# EAGLE design TaaraESP-SHT21 (EAGLE 7.2.0)
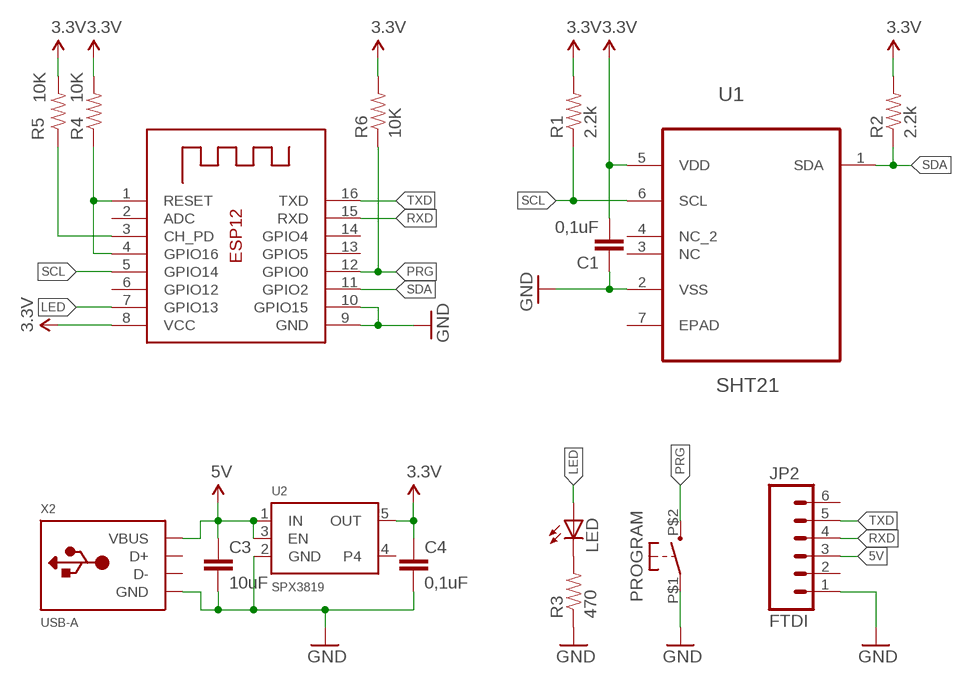
[diagram p0: schematic, sheet 1]

## Parts
C1  0,1uF  CAP0603-CAP  [0603-CAP]
C3  10uF  CAP0603-CAP  [0603-CAP]
C4  0,1uF  CAP0603-CAP  [0603-CAP]
JP2  FTDI  M06SIP_LOCK  [1X06-SIP_LOCK]
LED  LEDCHIPLED_0603  [CHIPLED_0603]
PROGRAM  OMRON_B3U-1000_TACT_SW  [BC3-1000]
R1  2.2k  RESISTOR0603-RES  [0603-RES]
R2  2.2k  RESISTOR0603-RES  [0603-RES]
R3  470  RESISTOR0603-RES  [0603-RES]
R4  10K  RESISTOR0603-RES  [0603-RES]
R5  10K  RESISTOR0603-RES  [0603-RES]
R6  10K  RESISTOR0603-RES  [0603-RES]
U1  SHT21  [DFN300X300X110-7N]
U2  SPX3819  VREG_SOT23-5  [SOT23-5]
X1  ESP-12  [ESP-12]
X2  USB-A  [MOLEX_480371000]

## Nets
3.3V: C1.2 C4.1 R1.2 R2.2 R4.2 R5.2 R6.2 U1.5(VDD) U2.5(OUT) X1.8(VCC)
5V: C3.1 JP2.3 U2.1(IN) U2.3(EN) X2.1(VBUS)
GND: C1.1 C3.2 C4.2 JP2.1 PROGRAM.P$1 R3.1 U1.2(VSS) U2.2(GND) X1.9(GND) X1.10(GPIO15) X2.4(GND)
LED: LED.A X1.7(GPIO13)
N$1: LED.C R3.2
N$2: R4.1 X1.1(RESET) X1.4(GPIO16)
N$3: R5.1 X1.3(CH_PD)
PRG: PROGRAM.P$2 R6.1 X1.12(GPIO0)
RXD: JP2.4 X1.15(RXD)
SCL: R1.1 U1.6(SCL) X1.5(GPIO14)
SDA: R2.1 U1.1(SDA) X1.11(GPIO2)
TXD: JP2.5 X1.16(TXD)
Unconnected: JP2.2 JP2.6 U1.3(NC) U1.4(NC_2) U1.7(EPAD) U2.4 X1.2(ADC) X1.6(GPIO12) X1.13(GPIO5) X1.14(GPIO4) X2.2(D-) X2.3(D+)

## Library data of the parts
C1 C3 C4 = SparkFun:CAP: Capacitor Standard 0603 ceramic capacitor, and 0.1" leaded capacitor.
JP2 = SparkFun:M06: Header 6 Standard 6-pin 0.1" header. Use with straight break away headers (SKU : PRT-00116), right angle break away headers (PRT-00553), swiss pins (PRT-00743), machine pins (PRT-00117), and female headers (PRT-00115). Molex polarized connector foot print use with SKU : PRT-08094 with associated crimp pins and housings. NOTES ON THE VARIANTS LOCK and LOCK_LONGPADS... This footprint was designed to help hold the alignment of a through-hole component (i.e. 6-pin header) while soldering it into place. You may notice that each hole has been shifted either up or down by 0.005 of an inch from it's more standard position (which is a perfectly straight line). This slight alteration caused the pins (the squares in the middle) to touch the edges of the holes. Because they are alternating, it causes a "brace" to hold the component in place. 0.005 has proven to be the perfect amount of "off-center" position when using our standard breakaway headers. Although looks a little odd when you look at the bare footprint, once you have a header in there, the alteration is very hard to notice. Also, if you push a header all the way into place, it is covered up entirely on the bottom side. This idea of altering the position of holes to aid alignment will be further integrated into the Sparkfun Library for other footprints. It can help hold any component with 3 or more connection pins.
LED = adafruit:LED: LED OSRAM: - CHIPLED LG R971, LG N971, LY N971, LG Q971, LY Q971, LO R971, LY R971 LH N974, LH R974 LS Q976, LO Q976, LY Q976 LO Q996 - Hyper CHIPLED LW Q18S LB Q993, LB Q99A, LB R99A - SideLED LS A670, LO A670, LY A670, LG A670, LP A670 LB A673, LV A673, LT A673, LW A673 LH A674 LY A675 LS A676, LA A676, LO A676, LY A676, LW A676 LS A679, LY A679, LG A679 - Hyper Micro SIDELED® LS Y876, LA Y876, LO Y876, LY Y876 LT Y87S - SmartLED LW L88C, LW L88S LB L89C, LB L89S, LG L890 LS L89K, LO L89K, LY L89K LS L896, LA L896, LO L896, LY L896 - TOPLED LS T670, LO T670, LY T670, LG T670, LP T670 LSG T670, LSP T670, LSY T670, LOP T670, LYG T670 LG T671, LOG T671, LSG T671 LB T673, LV T673, LT T673, LW T673 LH T674 LS T676, LA T676, LO T676, LY T676, LB T676, LH T676, LSB T676, LW T676 LB T67C, LV T67C, LT T67C, LS T67K, LO T67K, LY T67K, LW E67C LS E67B, LA E67B, LO E67B, LY E67B, LB E67C, LV E67C, LT E67C LW T67C LS T679, LY T679, LG T679 LS T770, LO T770, LY T770, LG T770, LP T770 LB T773, LV T773, LT T773, LW T773 LH T774 LS E675, LA E675, LY E675, LS T675 LS T776, LA T776, LO T776, LY T776, LB T776 LHGB T686 LT T68C, LB T68C - Hyper Mini TOPLED® LB M676 - Mini TOPLED Santana® LG M470 LS M47K, LO M47K, LY M47K Source: http://www.osram.convergy.de/
PROGRAM = ModernDevice:OMRON_B3U-1000_TACT_SW
R1-R6 = SparkFun:RESISTOR: Resistor Basic schematic elements and footprints for 0603, 1206, and PTH resistors.
U1 = Sensirion-SHT21:SHT21: SENSOR, HUMIDITY & TEMP; MPN: SHT21; OC_FARNELL: 1855468; OC_NEWARK: 20T1172; PACKAGE: DFN-6; SUPPLIER: SENSIRION
U2 = microbuilder:VREG_SOT23-5: SOT23-5 Fixed Voltage Regulators Part Current Out V Out V In V Dropout θJA (°C/W) TJ (°C) Digikey Part No. ADP121 150mA 3.3V 3.4-5.5V 0.09V @ 150mA -- -- ADP121-AUJZ33R7CT-ND ADP121 150mA 3.0V 3.1-5.5V 0.09V @ 150mA -- -- ADP121-AUJZ30R7CT-ND ADP122 300mA 3.3V 3.4-5.5V 0.085V @ 300mA -- -- ADP122AUJZ-3.3-R7CT-ND ADP1712 300mA 3.3V 3.5-5.5V 0.17V @ 300mA -- -- ADP1712AUJZ-3.3-R7TR-ND AP7311 (Low Cost) 150mA 3.3V 3.5-6V 0.15V @ 150mA -- -- AP7311-33WG-7DICT-ND LD39015M18R 150mA 1.8V 1.9V-5.5V 0.08V @ 100mA -- -- 497-6977-1-ND LP2985A-33DBVR 150mA 3.3V 3.3-16V 0.28V @ 150mA 206 150 296-18479-1-ND MCP1824T-3302E/OT 300mA 3.3V 3.5V-6V 0.2V @ 300mA -- -- MCP1824T-3302E/OTCT-ND MIC5205-2.5YM5 TR 150mA 2.5V 2.7-16V 0.165V @ 150mA -- -- 576-1257-2-ND MIC5205-3.0YM5 TR 150mA 3.0V 3.2V-16V 0.165V @ 150mA -- -- 576-1258-2-ND MIC5205-3.3YM5 TR 150mA 3.3V 3.5V-16V 0.165V @ 150mA -- -- 576-1259-2-ND TPS780330220 150mA 3.3V+2.2V 3.6-5.5V 250mV Max -- -- 296-23332-1-ND TDA3663/N1,135 100mA 3.3V 3.5-45V 0.18V @ 50mA -- -- 568-5343-1-ND Max operating temp can be calculated using θJA, TJ (max junction temperature), and power in watts. Set the "Maximum Ambient Temperature" until it reaches TJ ("Max Junction Temperature"), which is the absolute limit for safe use of the regulator: Heat Sink Temperature Calculator <http://www.daycounter.com/Calculators/Heat-Sink-Temperature-Calculator.phtml> For example, With 12V source into a 3.3V LP2985 and a 30mA load, we are dissipating (12V-3.3V) * 0.03A = 0.261W. With a θJA of 206 °C/W, a TJ of 150°C, and 261mW we can safely use the chip without a heat sink up to 75°C (=147.1°C Junction Temperature).
X1 = microbuilder:ESP-12
X2 = adafruit:USB-A: USB type A 'plug' Used for things that can directly connect to a USB port, say USB key

## Net classes
0 default: width 0.2 mm
1 power: width 0.2 mm

## Board
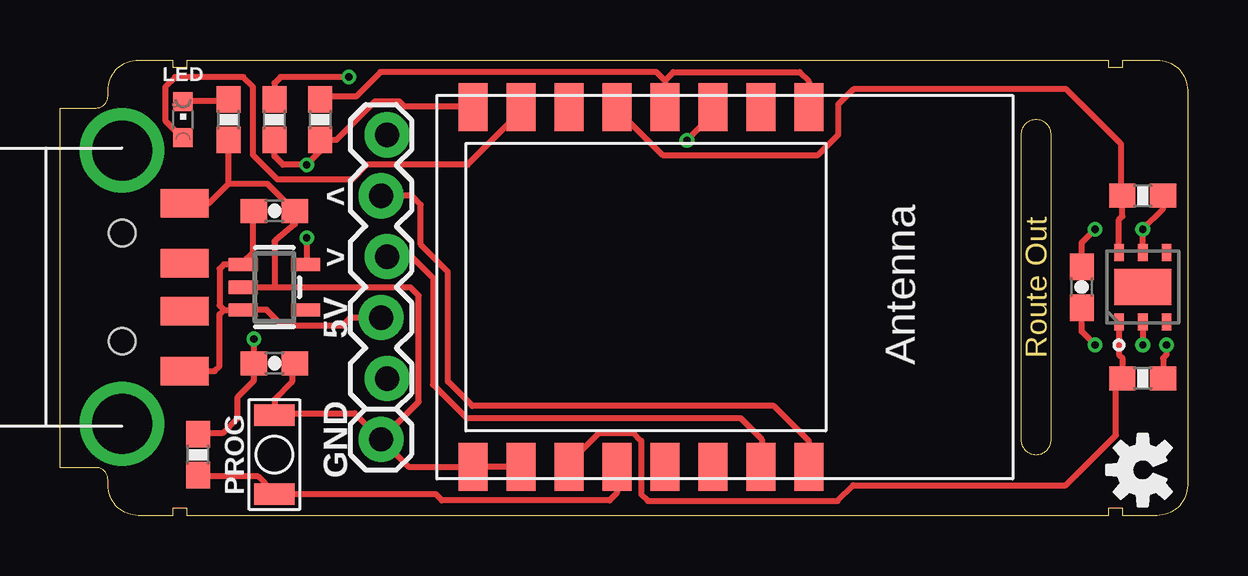
[diagram p1: board, top side]
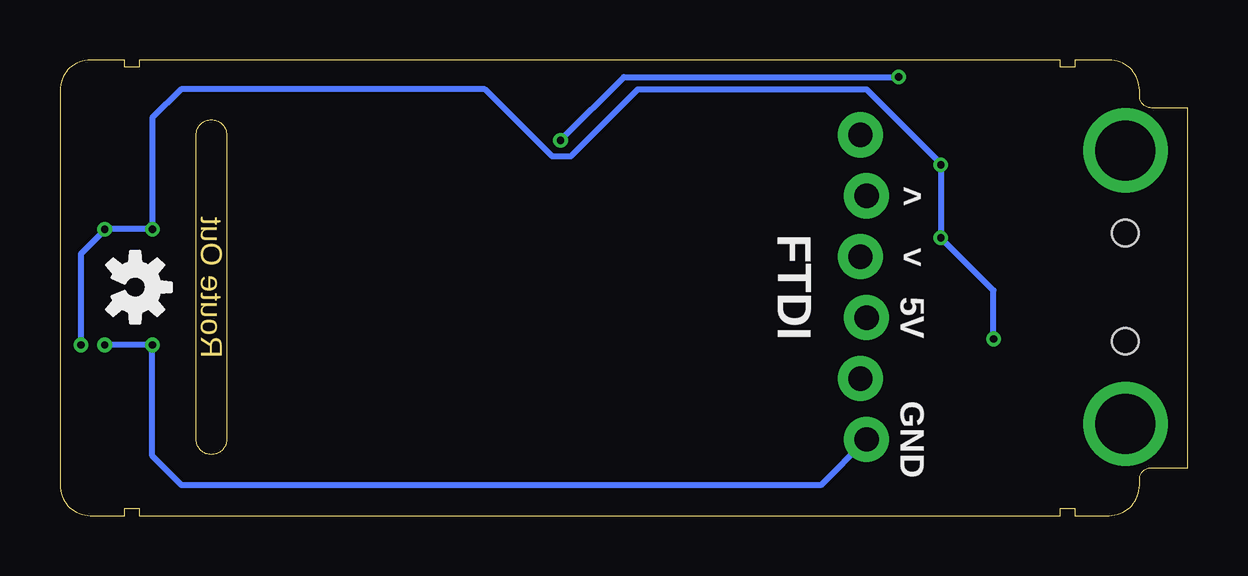
[diagram p2: board, bottom side, seen from below]

Size 47 x 19 mm. Coordinates in mm from the lower left corner, seen from the top.
Outline: 4.7,0 3.27,0 arc-90 2,1.27 2,1.5 arc90 1.5,2 0,2 0,17 1.5,17 arc90 2,17.5 2,17.73 arc-90 3.27,19 4.7,19 4.7,18.7 5.3,18.7 5.3,19 43.7,19 43.7,18.7 44.3,18.7 44.3,19 45.73,19 arc-90 47,17.73 47,1.27 arc-90 45.73,0 44.3,0 44.3,0.3 43.7,0.3 43.7,0 5.3,0 5.3,0.3 4.7,0.3 4.7,0
Outline: 40.05,15.88 40.05,3.17 arc90 40.69,2.54 arc90 41.32,3.17 41.32,15.88 arc90 40.69,16.51 arc90 40.05,15.88
Copper layers (1*16): Top 0.035mm / dielectric 1.5mm / Bottom 0.035mm
Design rules "default *": minimum track width 10mil, minimum drill 12mil, track to track 6mil, track to pad 6mil, pad to pad 6mil, via to via 6mil, smd to smd 0mil, copper to edge 10mil, drill to drill 10mil, minimum pad ring 10mil, minimum via ring 6mil, stop-mask expansion 2mil, vias tented up to drill 100mil, thermal gap 10mil

### Footprints (pad centres in the part's own frame; a part is rotated, then mirrored left to right if it is on the bottom)
0603-CAP = smd 1.1 x 1: 1 -0.85,0; 2 0.85,0
1X06-SIP_LOCK = drill 1.016 pad 1.88: 1 0,0; 2 2.54,-0.254; 3 5.08,0; 4 7.62,-0.254; 5 10.16,0; 6 12.7,-0.254
CHIPLED_0603 = smd 0.8 x 0.8: A 0,-0.75; C 0,0.75
BC3-1000 = smd 0.9 x 1.7: P$1 1.65,0; P$2 -1.65,0
0603-RES = smd 1.1 x 1: 1 -0.85,0; 2 0.85,0
DFN300X300X110-7N = smd 0.711 x 0.406: 1 -1.448,0.991; 2 -1.448,0; 3 -1.448,-0.991; 4 1.448,-0.991; 5 1.448,0; 6 1.448,0.991 | smd 1.499 x 2.388: 7 0,0
SOT23-5 = smd 0.55 x 1.2: 1 -0.95,-1.3; 2 0,-1.3; 3 0.95,-1.3; 4 0.95,1.3; 5 -0.95,1.3
ESP-12 = smd 2 x 1.2: 1 -7.5,4.5; 2 -7.5,2.5; 3 -7.5,0.5; 4 -7.5,-1.5; 5 -7.5,-3.5; 6 -7.5,-5.5; 7 -7.5,-7.5; 8 -7.5,-9.5; 9 7.5,-9.5; 10 7.5,-7.5; 11 7.5,-5.5; 12 7.5,-3.5; 13 7.5,-1.5; 14 7.5,0.5; 15 7.5,2.5; 16 7.5,4.5
MOLEX_480371000 = smd 1.2 x 2: 1 3.5,2.6; 2 1,2.6; 3 -1,2.6; 4 -3.5,2.6 | drill 2.5: M1 -5.7,0; M2 5.7,0 | hole 1.1: -2.25,0; 2.25,0

### Placement (x,y rotation side)
C1  42.59,9.53 90 top
C3  8.94,12.7 0 top
C4  8.94,6.35 0 top
JP2  13.38,3.17 90 top
LED  5.13,16.51 0 top
PROGRAM  8.94,2.54 90 top
R1  45.13,13.34 0 top
R2  45.13,5.71 0 top
R3  7.03,16.51 90 top
R4  10.84,16.51 270 top
R5  8.94,16.51 270 top
R6  5.76,2.54 90 top
U1  45.13,9.53 90 top
U2  8.94,9.53 270 top
U$1  [OSHW-LOGO-S]  45.13,1.91 90 top
U$5  [OSHW-LOGO-S]  43.86,9.53 270 bottom
X1  26.72,9.53 270 top
X2  2.59,9.53 270 top

### Tracks (layer width: path | path; a pad name or v marks a point on that pad's centre or on a via)
3.3V  (via drill 0.3)
  Top 0.254: 10.69,15.85 R4.2 | v10.28,11.58 10.28,10.57 U2.5 | X1.8 17.19,17.07 14.35,17.07 14.14,17.27 13.13,17.27 11.52,15.66 R4.2 | R6.2 5.81,3.45 6.8,3.45 7.41,4.06 7.41,4.95 8.09,5.63 C4.1 v8.09,7.37 | R4.2 10.84,15.19 v10.28,14.63 9.29,14.63 8.94,14.99 R5.2 | 45.77,5.71 45.84,5.79 45.84,5.89 R2.2 45.98,6.57 46.12,6.71 v46.12,7.11 | U1.5 v45.13,11.94 45.98,12.79 R1.2 | C1.2 42.59,11.38 v43.15,11.94
  Bottom 0.254: v8.09,7.37 8.09,9.39 v10.28,11.58 v10.28,14.63 10.28,14.68 13.38,17.78 22.91,17.78 25.7,14.99 26.49,14.99 29.28,17.78 41.96,17.78 43.15,16.59 v43.15,11.94 v45.13,11.94 45.13,11.91 46.12,10.92 v46.12,7.11
5V
  Top 0.254: C3.1 8.05,12.6 8.05,10.97 7.64,10.57 U2.1 6.84,10.47 6.65,10.29 6.65,8.76 6.84,8.57 | 5,6.1 X2.1 6.45,6.03 6.65,6.22 6.65,8.39 6.84,8.57 | 7.64,8.53 U2.3 | JP2.3 12.11,8.26 11.78,7.92 9.27,7.92 8.62,8.57 U2.3 | 6.84,8.57 U2.3
GND  (via drill 0.3)
  Top 0.254: 7.03,15.44 R3.1 7.03,13.84 | 9.68,12.8 C3.2 | 9.68,12.6 C3.2 | X1.10 19.02,2.03 17.4,2.03 X1.9 17.19,2.03 14.53,2.03 JP2.1 | C4.2 9.68,6.3 9.68,5.56 8.94,4.83 PROGRAM.P$1 9.07,4.27 12.29,4.27 JP2.1 | C3.2 9.79,12.15 9.01,11.51 8.94,11.43 8.94,9.53 | U2.2 8.94,9.53 | 8.94,9.53 14.6,9.53 14.96,9.17 14.96,4.75 JP2.1 | X2.4 6.22,13.03 7.03,13.84 | 7.03,13.84 8.64,13.84 C3.2 | U1.2 v45.13,7.11 | v43.15,7.11 42.59,7.67 C1.1
  Bottom 0.254: v45.13,7.11 v43.15,7.11 43.15,2.49 41.93,1.27 15.29,1.27 JP2.1
LED
  Top 0.254: LED.A 5,15.85 4.39,16.46 4.39,17.88 4.8,18.29 7.64,18.29 8.05,17.88 8.05,15.04 9.07,14.02 12.19,14.02 12.8,14.63 16.99,14.63 19.23,16.87 X1.7
N$1
  Top 0.254: LED.C 5.2,17.27 7.03,17.27 R3.2
N$2
  Top 0.254: R4.1 10.89,17.48 12.34,17.48 13.36,18.49 24.86,18.49 25.22,18.14 | 31.21,17.07 X1.1 31.22,18.11 30.83,18.49 25.57,18.49 25.22,18.14 | 25.22,18.14 X1.4
N$3  (via drill 0.3)
  Top 0.254: v26.13,15.65 27.35,16.87 X1.3 | v12.04,18.29 9.19,18.29 8.94,18.03 R5.1
  Bottom 0.254: v12.04,18.29 23.49,18.29 v26.13,15.65
PRG
  Top 0.254: R6.1 5.81,1.63 8.25,1.63 8.86,1.02 PROGRAM.P$2 | 9.07,0.81 PROGRAM.P$2 | X1.12 23.22,0.94 22.91,0.64 15.92,0.64 15.67,0.89 PROGRAM.P$2
RXD
  Top 0.254: 29.18,2.03 X1.15 29.26,2.06 29.26,3.17 28.37,4.06 16.94,4.06 15.54,5.46 15.54,9.91 14.65,10.79 JP2.4
SCL
  Top 0.254: X1.5 23.29,16.87 25.12,15.04 31.6,15.04 32.43,15.88 32.43,17.14 33.07,17.78 41.96,17.78 44.22,15.52 44.22,13.41 R1.1 44.28,12.48 44.14,12.34 U1.6
SDA
  Top 0.254: X1.11 21.05,2.03 22.48,3.45 23.9,3.45 24.23,3.12 24.23,0.89 24.51,0.61 32.41,0.61 33.07,1.27 41.93,1.27 44.02,3.35 44.02,5.69 R2.1 44.28,6.57 44.14,6.71 U1.1
TXD
  Top 0.254: X1.16 31.22,3.12 29.77,4.57 17.19,4.57 16.18,5.59 16.18,10.16 15.03,11.3 15.03,12.95 14.65,13.34 JP2.5

### Text on the board
Dimension: Route Out
tNames: < | > | 5V | PROG | GND
bNames: > | < | FTDI | 5V | GND
_bsilk: TaaraESP SHT21 v1 | TaaraLabs.eu/es1